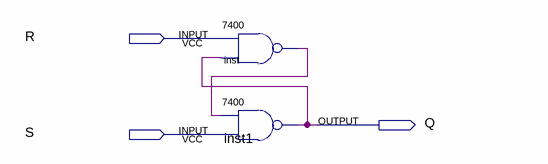
[diagram p0: schematic sheet]
// Quartus schematic Experiment51.bdf as structural Verilog: 2 symbols, 3 pins
module Experiment51 (
  input  R,
  input  S,
  output Q
);

  wire inst_1;

  \7400  inst (.\3 (Q), .\2 (R), .\1 (inst_1));
  \7400  inst1 (.\3 (S), .\2 (inst_1), .\1 (Q));
endmodule
